# Altium schematic sheet HV BOX.SchDoc
size A4
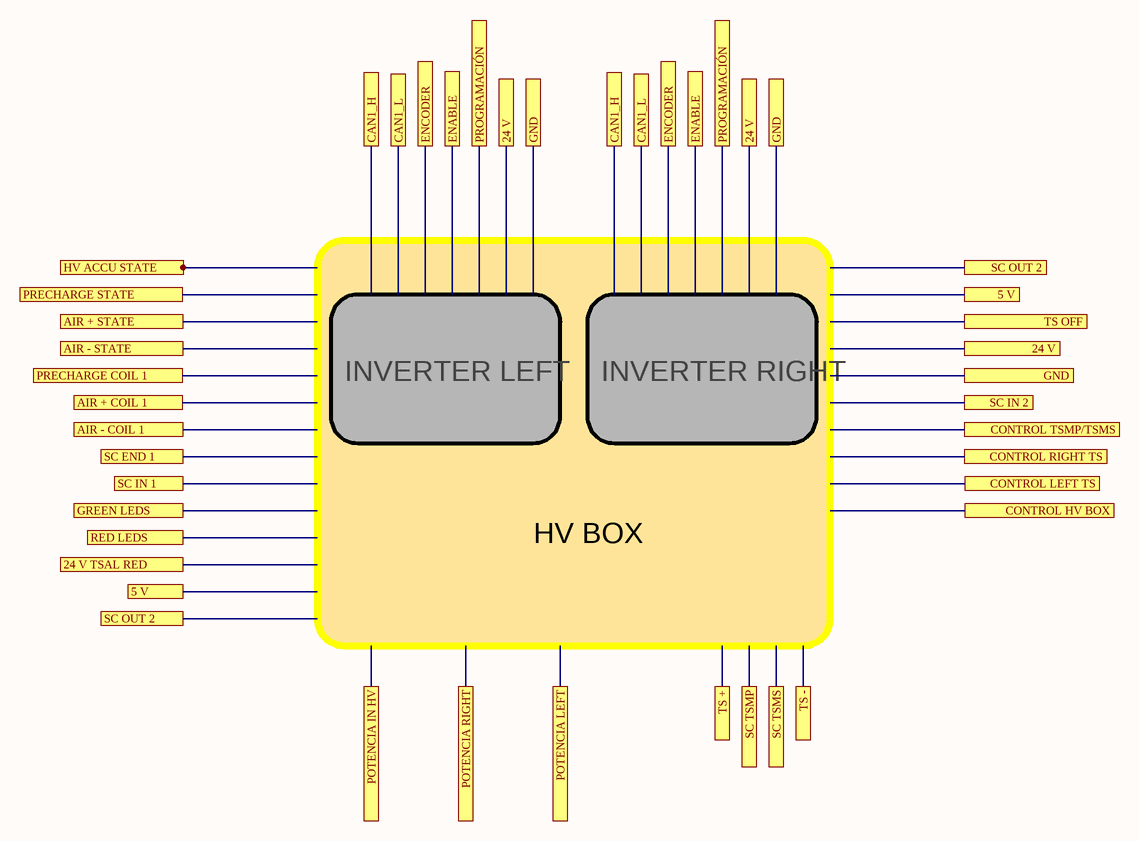
[diagram p0: HV BOX.SchDoc]

## Ports
5 V (see HV BOX[1C]), 5 V (see HV BOX[3B]), 24 V (see DASH[1B], Rear ECU[1B]), 24 V (see HV BOX[2A]), 24 V TSAL RED, AIR + COIL 1, AIR + STATE, AIR - COIL 1, AIR - STATE, CAN1_H (see DASH[1B], Front_ECU[3B], HV BOX[2A], Rear ECU[3B]), CAN1_L (see DASH[1B], Front_ECU[3B], HV BOX[2A], Rear ECU[3B]), CONTROL HV BOX, CONTROL LEFT TS, CONTROL RIGHT TS, CONTROL TSMP/TSMS, ENABLE (see HV BOX[2A]), ENCODER (see HV BOX[2A]), GND (see DASH[1B], Front_ECU[3B], HV BOX[2A], HV BOX[3A], Rear ECU[1B], Rear ECU[3B]), GND (see DASH[1B], Front_ECU[3B], HV BOX[2A], HV BOX[3B], Rear ECU[1B], Rear ECU[3B]), GND (see DASH[1B], Front_ECU[3B], HV BOX[3A], HV BOX[3B], Rear ECU[1B], Rear ECU[3B]), GREEN LEDS, HV ACCU STATE, POTENCIA IN HV, POTENCIA LEFT, POTENCIA RIGHT, PRECHARGE COIL 1, PRECHARGE STATE, PROGRAMACIÓN (see HV BOX[2A]), RED LEDS, SC END 1, SC IN 1, SC IN 2, SC OUT 2 (see HV BOX[1C]), SC OUT 2 (see HV BOX[3B]), SC TSMP, SC TSMS, TS +, TS -, TS OFF (see DASH[3B])

## Notes on the sheet
- INVERTER LEFT
- INVERTER RIGHT
- HV BOX